# Altium schematic sheet [04] - Keyboard.SchDoc: Mantra Display Board
size A4; Author: MikrySoft; Address1: MikrySoft@gmail.com; DocumentNumber: 5; Revision: 1; SheetNumber: 5; SheetTotal: 7
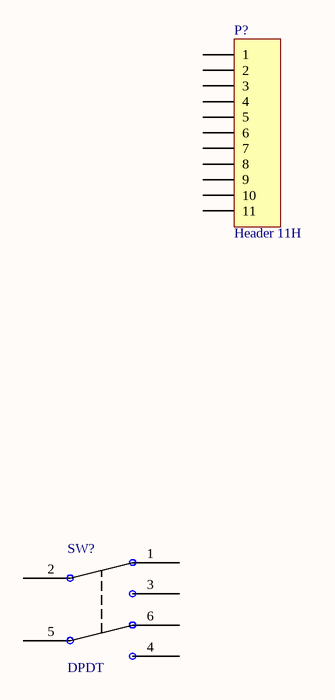
[diagram p0: [04] - Keyboard.SchDoc]

## Parts
P?  Header 11H  [HDR1X11H]
SW?  DPDT  [SW-EG2215]

## Nets

Not connected (* = marked no-connect by the designer): P? 1 2 3 4 5 6 7 8 9 10 11; SW? 1(NC-1) 2(CC-1) 3(NO-1) 4(NO-2) 5(CC-2) 6(NC-2)

## Notes on the sheet
- Title
- Size:
- Date:
- A4
- Number:
- Time:
- Revision:
- Sheet
- of
- Variation:
- Author:
- E-Mail:
- File:

## Library data of the parts
P? = Header 11H: Header, 11-Pin, Right Angle; LatestRevisionDate: 17-Jul-2002; LatestRevisionNote: Re-released for DXP Platform.; Publisher: Altium Limited
SW? = SW-DPDT